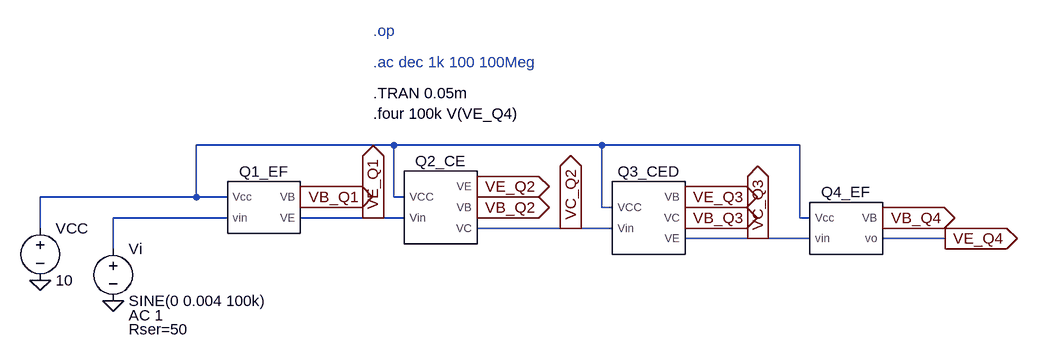
[diagram p0: schematic dp1_amp_sim.asc]
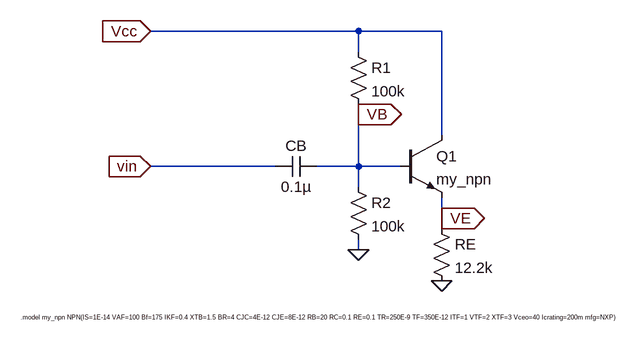
[diagram p1: sub-circuit ef_npn_q1.asc]
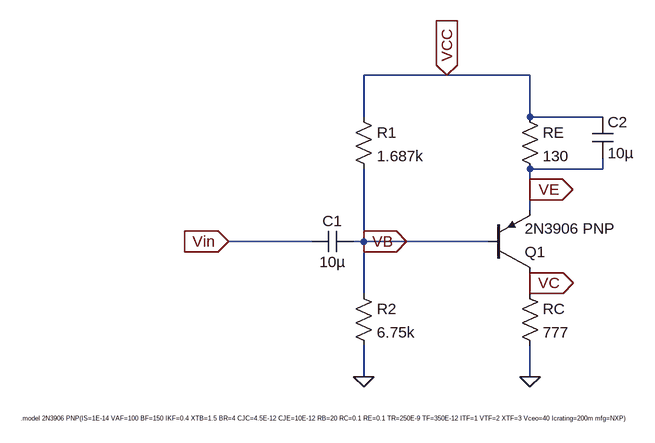
[diagram p2: sub-circuit ce_pnp_q2.asc]
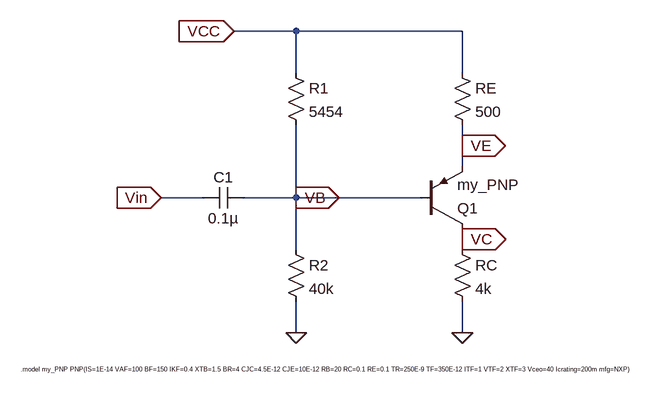
[diagram p3: sub-circuit ced_pnp_q3.asc]
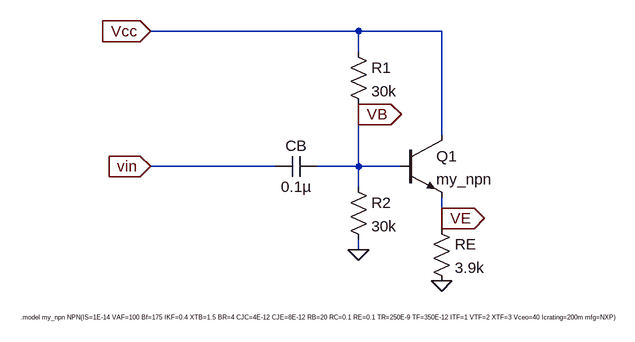
[diagram p4: sub-circuit ef_npn_q4.asc]
dp1_amp_sim.asc, the LTspice schematic file:
Version 4
SHEET 1 2800 1584
WIRE 320 624 16 624
WIRE 640 624 320 624
WIRE 944 624 640 624
WIRE 16 704 16 624
WIRE 16 704 -224 704
WIRE 64 704 16 704
WIRE 320 704 320 624
WIRE 336 704 320 704
WIRE 640 720 640 624
WIRE 656 720 640 720
WIRE 64 736 -112 736
WIRE 288 736 176 736
WIRE 336 736 288 736
WIRE 944 736 944 624
WIRE 960 736 944 736
WIRE -224 752 -224 704
WIRE 592 752 448 752
WIRE 656 752 592 752
WIRE 880 768 768 768
WIRE 960 768 880 768
WIRE 1168 768 1072 768
WIRE -112 784 -112 736
FLAG -224 832 0
FLAG -112 864 0
FLAG 176 704 VB_Q1
IOPIN 176 704 Out
FLAG 288 736 VE_Q1
IOPIN 288 736 Out
FLAG 448 688 VE_Q2
IOPIN 448 688 Out
FLAG 448 720 VB_Q2
IOPIN 448 720 Out
FLAG 592 752 VC_Q2
IOPIN 592 752 Out
FLAG 768 704 VE_Q3
IOPIN 768 704 Out
FLAG 768 736 VB_Q3
IOPIN 768 736 Out
FLAG 880 768 VC_Q3
IOPIN 880 768 Out
FLAG 1072 736 VB_Q4
IOPIN 1072 736 Out
FLAG 1168 768 VE_Q4
IOPIN 1168 768 Out
SYMBOL voltage -224 736 R0
SYMATTR InstName VCC
SYMATTR Value 10
SYMBOL voltage -112 768 R0
WINDOW 123 24 118 Left 2
WINDOW 39 24 140 Left 2
SYMATTR Value2 AC 1
SYMATTR SpiceLine Rser=50
SYMATTR InstName Vi
SYMATTR Value SINE(0 0.004 100k)
SYMBOL EF_NPN_Q1 112 720 R0
SYMATTR InstName Q1_EF
SYMBOL CE_pnp_Q2 384 720 R0
SYMATTR InstName Q2_CE
SYMBOL CED_pnp_Q3 704 736 R0
SYMATTR InstName Q3_CED
SYMBOL EF_NPN_Q4 1008 752 R0
SYMATTR InstName Q4_EF
TEXT 288 448 Left 2 ;.op
TEXT 288 496 Left 2 ;.ac dec 1k 100 100Meg
TEXT 288 544 Left 2 !.TRAN 0.05m\n.four 100k V(VE_Q4)

ef_npn_q1.asc, the sub-circuit schematic file:
Version 4
SHEET 1 2800 760
WIRE 352 144 32 144
WIRE 480 144 352 144
WIRE 352 176 352 144
WIRE 352 272 352 256
WIRE 480 304 480 144
WIRE 224 352 32 352
WIRE 352 352 352 272
WIRE 352 352 288 352
WIRE 416 352 352 352
WIRE 352 384 352 352
WIRE 480 432 480 400
WIRE 480 448 480 432
WIRE 352 480 352 464
FLAG 480 528 0
FLAG 352 480 0
FLAG 480 432 VE
IOPIN 480 432 Out
FLAG 352 272 VB
IOPIN 352 272 Out
FLAG 32 144 Vcc
IOPIN 32 144 In
FLAG 32 352 vin
IOPIN 32 352 In
SYMBOL npn 416 304 R0
SYMATTR InstName Q1
SYMATTR Value my_npn
SYMBOL Res 464 432 R0
SYMATTR InstName RE
SYMATTR Value 12.2k
SYMBOL Res 336 160 R0
SYMATTR InstName R1
SYMATTR Value 100k
SYMBOL Res 336 368 R0
SYMATTR InstName R2
SYMATTR Value 100k
SYMBOL Cap 288 336 R90
WINDOW 0 0 32 VBottom 2
WINDOW 3 32 32 VTop 2
SYMATTR InstName CB
SYMATTR Value 0.1µ
TEXT -168 584 Left 0 !.model my_npn NPN(IS=1E-14 VAF=100 Bf=175 IKF=0.4 XTB=1.5 BR=4 CJC=4E-12 CJE=8E-12 RB=20 RC=0.1 RE=0.1 TR=250E-9 TF=350E-12 ITF=1 VTF=2 XTF=3 Vceo=40 Icrating=200m mfg=NXP)

ce_pnp_q2.asc, the sub-circuit schematic file:
Version 4
SHEET 1 2152 808
WIRE 608 96 480 96
WIRE 736 96 608 96
WIRE 480 160 480 96
WIRE 736 160 736 96
WIRE 848 160 736 160
WIRE 848 240 848 224
WIRE 848 240 736 240
WIRE 736 272 736 240
WIRE 736 304 736 272
WIRE 400 352 272 352
WIRE 480 352 480 240
WIRE 480 352 464 352
WIRE 672 352 480 352
WIRE 736 416 736 400
WIRE 480 432 480 352
WIRE 736 432 736 416
WIRE 480 560 480 512
WIRE 736 560 736 512
FLAG 480 560 0
FLAG 736 560 0
FLAG 608 96 VCC
IOPIN 608 96 In
FLAG 272 352 Vin
IOPIN 272 352 In
FLAG 480 352 VB
IOPIN 480 352 Out
FLAG 736 416 VC
IOPIN 736 416 Out
FLAG 736 272 VE
IOPIN 736 272 Out
SYMBOL Res 464 144 R0
SYMATTR InstName R1
SYMATTR Value 1.687k
SYMBOL Res 464 416 R0
SYMATTR InstName R2
SYMATTR Value 6.75k
SYMBOL Res 720 144 R0
SYMATTR InstName RE
SYMATTR Value 130
SYMBOL Cap 464 336 R90
WINDOW 0 0 32 VBottom 2
WINDOW 3 32 32 VTop 2
SYMATTR InstName C1
SYMATTR Value 10µ
SYMBOL pnp 672 400 M180
SYMATTR InstName Q1
SYMATTR Value 2N3906 PNP
SYMBOL Res 720 416 R0
SYMATTR InstName RC
SYMATTR Value 777
SYMBOL Cap 832 160 R0
SYMATTR InstName C2
SYMATTR Value 10µ
TEXT -48 624 Left 0 !.model 2N3906 PNP(IS=1E-14 VAF=100 BF=150 IKF=0.4 XTB=1.5 BR=4 CJC=4.5E-12 CJE=10E-12 RB=20 RC=0.1 RE=0.1 TR=250E-9 TF=350E-12 ITF=1 VTF=2 XTF=3 Vceo=40 Icrating=200m mfg=NXP)

ced_pnp_q3.asc, the sub-circuit schematic file:
Version 4
SHEET 1 2272 688
WIRE 208 32 112 32
WIRE 464 32 208 32
WIRE 208 96 208 32
WIRE 464 96 464 32
WIRE 464 208 464 176
WIRE 464 240 464 208
WIRE 64 288 0 288
WIRE 208 288 208 176
WIRE 208 288 128 288
WIRE 400 288 208 288
WIRE 464 352 464 336
WIRE 208 368 208 288
WIRE 464 368 464 352
WIRE 208 496 208 448
WIRE 464 496 464 448
FLAG 208 496 0
FLAG 464 496 0
FLAG 0 288 Vin
IOPIN 0 288 In
FLAG 208 288 VB
IOPIN 208 288 Out
FLAG 464 208 VE
IOPIN 464 208 Out
FLAG 464 352 VC
IOPIN 464 352 Out
FLAG 112 32 VCC
IOPIN 112 32 In
SYMBOL Res 192 80 R0
SYMATTR InstName R1
SYMATTR Value 5454
SYMBOL Res 192 352 R0
SYMATTR InstName R2
SYMATTR Value 40k
SYMBOL Res 448 80 R0
SYMATTR InstName RE
SYMATTR Value 500
SYMBOL Cap 128 272 R90
WINDOW 0 0 32 VBottom 2
WINDOW 3 32 32 VTop 2
SYMATTR InstName C1
SYMATTR Value 0.1µ
SYMBOL Res 448 352 R0
SYMATTR InstName RC
SYMATTR Value 4k
SYMBOL pnp 400 336 M180
SYMATTR InstName Q1
SYMATTR Value my_PNP
TEXT -216 552 Left 0 !.model my_PNP PNP(IS=1E-14 VAF=100 BF=150 IKF=0.4 XTB=1.5 BR=4 CJC=4.5E-12 CJE=10E-12 RB=20 RC=0.1 RE=0.1 TR=250E-9 TF=350E-12 ITF=1 VTF=2 XTF=3 Vceo=40 Icrating=200m mfg=NXP)

ef_npn_q4.asc, the sub-circuit schematic file:
Version 4
SHEET 1 2800 760
WIRE 352 144 32 144
WIRE 480 144 352 144
WIRE 352 176 352 144
WIRE 352 272 352 256
WIRE 480 304 480 144
WIRE 224 352 32 352
WIRE 352 352 352 272
WIRE 352 352 288 352
WIRE 416 352 352 352
WIRE 352 384 352 352
WIRE 480 432 480 400
WIRE 480 448 480 432
WIRE 352 480 352 464
FLAG 480 528 0
FLAG 352 480 0
FLAG 480 432 VE
IOPIN 480 432 Out
FLAG 352 272 VB
IOPIN 352 272 Out
FLAG 32 144 Vcc
IOPIN 32 144 In
FLAG 32 352 vin
IOPIN 32 352 In
SYMBOL npn 416 304 R0
SYMATTR InstName Q1
SYMATTR Value my_npn
SYMBOL Res 464 432 R0
SYMATTR InstName RE
SYMATTR Value 3.9k
SYMBOL Res 336 160 R0
SYMATTR InstName R1
SYMATTR Value 30k
SYMBOL Res 336 368 R0
SYMATTR InstName R2
SYMATTR Value 30k
SYMBOL Cap 288 336 R90
WINDOW 0 0 32 VBottom 2
WINDOW 3 32 32 VTop 2
SYMATTR InstName CB
SYMATTR Value 0.1µ
TEXT -168 584 Left 0 !.model my_npn NPN(IS=1E-14 VAF=100 Bf=175 IKF=0.4 XTB=1.5 BR=4 CJC=4E-12 CJE=8E-12 RB=20 RC=0.1 RE=0.1 TR=250E-9 TF=350E-12 ITF=1 VTF=2 XTF=3 Vceo=40 Icrating=200m mfg=NXP)

The netlist it stands for:
* dp1_amp_sim.asc
VCC N001 0 10
Vi N002 0 SINE(0 0.004 100k) AC 1 Rser=50
XQ1_EF N001 N002 VB_Q1 VE_Q1 ef_npn_q1
XQ2_CE N001 VE_Q1 VB_Q2 VC_Q2 VE_Q2 ce_pnp_q2
XQ3_CED N001 VC_Q2 VE_Q3 VB_Q3 VC_Q3 ced_pnp_q3
XQ4_EF N001 VC_Q3 VB_Q4 VE_Q4 ef_npn_q4

* block symbol definitions
.subckt ef_npn_q1 Vcc vin VB VE
Q1 Vcc VB VE 0 my_npn
RE VE 0 12.2k
R1 Vcc VB 100k
R2 VB 0 100k
CB VB vin 0.1µ
.model my_npn NPN(IS=1E-14 VAF=100 Bf=175 IKF=0.4 XTB=1.5 BR=4 CJC=4E-12 CJE=8E-12 RB=20 RC=0.1 RE=0.1 TR=250E-9 TF=350E-12 ITF=1 VTF=2 XTF=3 Vceo=40 Icrating=200m mfg=NXP)
.ends ef_npn_q1

.subckt ce_pnp_q2 VCC Vin VB VC VE
R1 VCC VB 1.687k
R2 VB 0 6.75k
RE VCC VE 130
C1 VB Vin 10µ
Q1 VC VB VE 0 2N3906 PNP
RC VC 0 777
C2 VCC VE 10µ
.model 2N3906 PNP(IS=1E-14 VAF=100 BF=150 IKF=0.4 XTB=1.5 BR=4 CJC=4.5E-12 CJE=10E-12 RB=20 RC=0.1 RE=0.1 TR=250E-9 TF=350E-12 ITF=1 VTF=2 XTF=3 Vceo=40 Icrating=200m mfg=NXP)
.ends ce_pnp_q2

.subckt ced_pnp_q3 VCC Vin VB VC VE
R1 VCC VB 5454
R2 VB 0 40k
RE VCC VE 500
C1 VB Vin 0.1µ
RC VC 0 4k
Q1 VC VB VE 0 my_PNP
.model my_PNP PNP(IS=1E-14 VAF=100 BF=150 IKF=0.4 XTB=1.5 BR=4 CJC=4.5E-12 CJE=10E-12 RB=20 RC=0.1 RE=0.1 TR=250E-9 TF=350E-12 ITF=1 VTF=2 XTF=3 Vceo=40 Icrating=200m mfg=NXP)
.ends ced_pnp_q3

.subckt ef_npn_q4 Vcc vin VB vo
Q1 Vcc VB VE 0 my_npn
RE VE 0 3.9k
R1 Vcc VB 30k
R2 VB 0 30k
CB VB vin 0.1µ
.model my_npn NPN(IS=1E-14 VAF=100 Bf=175 IKF=0.4 XTB=1.5 BR=4 CJC=4E-12 CJE=8E-12 RB=20 RC=0.1 RE=0.1 TR=250E-9 TF=350E-12 ITF=1 VTF=2 XTF=3 Vceo=40 Icrating=200m mfg=NXP)
.ends ef_npn_q4

.model NPN NPN
.model PNP PNP
.lib standard.bjt
* .op
* .ac dec 1k 100 100Meg
.TRAN 0.05m
.four 100k V(VE_Q4)
.backanno
.end